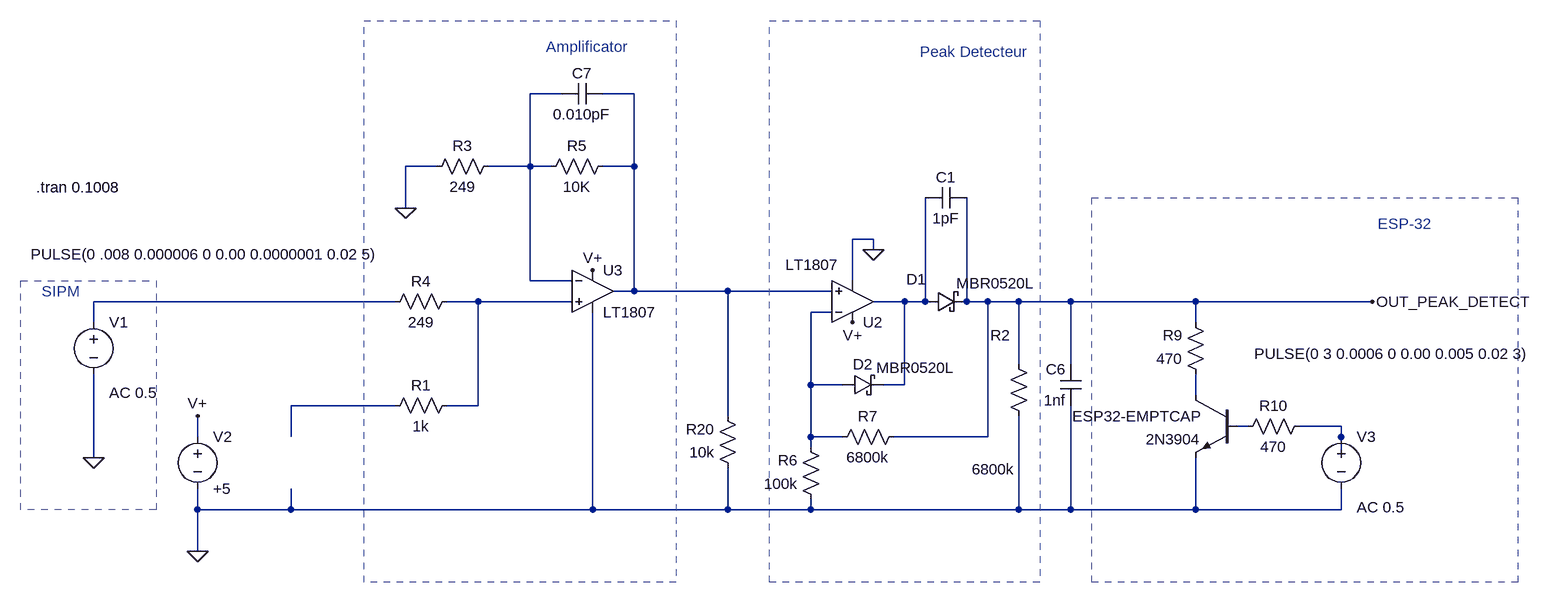
[diagram p0: schematic Muons_V4_a.asc]
Muons_V4_a.asc, the LTspice schematic file:
Version 4
SHEET 1 5945676 13421556
WIRE 624 -368 576 -368
WIRE 736 -368 688 -368
WIRE 432 -256 384 -256
WIRE 576 -256 576 -368
WIRE 576 -256 512 -256
WIRE 608 -256 576 -256
WIRE 736 -256 736 -368
WIRE 736 -256 688 -256
WIRE 384 -192 384 -256
WIRE 1104 -144 1072 -144
WIRE 1104 -128 1104 -144
WIRE 576 -80 576 -256
WIRE 640 -80 576 -80
WIRE 1072 -80 1072 -144
WIRE 736 -64 736 -256
WIRE 736 -64 704 -64
WIRE 880 -64 736 -64
WIRE 1040 -64 880 -64
WIRE 368 -48 -96 -48
WIRE 496 -48 448 -48
WIRE 640 -48 496 -48
WIRE 1152 -48 1104 -48
WIRE 1184 -48 1184 -208
WIRE 1184 -48 1152 -48
WIRE 1248 -48 1248 -208
WIRE 1280 -48 1248 -48
WIRE 1328 -48 1280 -48
WIRE 1408 -48 1328 -48
WIRE 1600 -48 1408 -48
WIRE 1872 -48 1600 -48
WIRE 1040 -32 1008 -32
WIRE -96 -16 -96 -48
WIRE 1600 -16 1600 -48
WIRE 1328 48 1328 -48
WIRE 1408 48 1408 -48
WIRE 1008 80 1008 -32
WIRE 1056 80 1008 80
WIRE 1152 80 1152 -48
WIRE 1152 80 1120 80
WIRE 1600 96 1600 64
WIRE 368 112 208 112
WIRE 496 112 496 -48
WIRE 496 112 448 112
WIRE 880 128 880 -64
WIRE 1680 144 1664 144
WIRE 1824 144 1760 144
WIRE 64 160 64 128
WIRE 208 160 208 112
WIRE 1008 160 1008 80
WIRE 1056 160 1008 160
WIRE 1280 160 1280 -48
WIRE 1280 160 1136 160
WIRE 1824 160 1824 144
WIRE 1008 176 1008 160
WIRE -96 192 -96 64
WIRE 1824 192 1824 160
WIRE 64 272 64 240
WIRE 208 272 208 240
WIRE 208 272 64 272
WIRE 672 272 672 -32
WIRE 672 272 208 272
WIRE 880 272 880 208
WIRE 880 272 672 272
WIRE 1008 272 1008 256
WIRE 1008 272 880 272
WIRE 1328 272 1328 128
WIRE 1328 272 1008 272
WIRE 1408 272 1408 112
WIRE 1408 272 1328 272
WIRE 1600 272 1600 192
WIRE 1600 272 1408 272
WIRE 1824 272 1824 240
WIRE 1824 272 1600 272
WIRE 64 336 64 272
FLAG -96 192 0
FLAG 64 336 0
FLAG 672 -96 V+
FLAG 64 128 V+
FLAG 384 -192 0
FLAG 1872 -48 OUT_PEAK_DETECT
FLAG 1072 -16 V+
FLAG 1104 -128 0
SYMBOL voltage -96 -32 R0
WINDOW 123 24 124 Left 2
WINDOW 39 0 0 Left 0
WINDOW 3 -97 -89 Left 2
SYMATTR Value2 AC 0.5
SYMATTR Value PULSE(0 .008 0.000006 0 0.00 0.0000001 0.02 5)
SYMATTR InstName V1
SYMBOL res 704 -272 R90
WINDOW 0 0 56 VBottom 2
WINDOW 3 32 56 VTop 2
SYMATTR InstName R5
SYMATTR Value 10K
SYMBOL res 464 -64 R90
WINDOW 0 0 56 VBottom 2
WINDOW 3 32 56 VTop 2
SYMATTR InstName R4
SYMATTR Value 249
SYMBOL res 528 -272 R90
WINDOW 0 0 56 VBottom 2
WINDOW 3 32 56 VTop 2
SYMATTR InstName R3
SYMATTR Value 249
SYMBOL cap 688 -384 R90
WINDOW 0 0 32 VBottom 2
WINDOW 3 32 32 VTop 2
SYMATTR InstName C7
SYMATTR Value 0.010pF
SYMBOL voltage 64 144 R0
WINDOW 123 0 0 Left 0
WINDOW 39 0 0 Left 0
SYMATTR InstName V2
SYMATTR Value +5
SYMBOL res 896 224 R180
WINDOW 0 36 76 Left 2
WINDOW 3 36 40 Left 2
SYMATTR InstName R20
SYMATTR Value 10k
SYMBOL cap 1424 112 R180
WINDOW 0 24 56 Left 2
WINDOW 3 24 8 Left 2
SYMATTR InstName C6
SYMATTR Value 1nf
SYMBOL OpAmps\\LT1807 1072 16 M180
WINDOW 3 -103 121 Left 2
SYMATTR InstName U2
SYMBOL OpAmps\\LT1807 672 -128 R0
SYMATTR InstName U3
SYMBOL schottky 1184 -32 R270
WINDOW 0 35 -14 VTop 2
WINDOW 3 60 108 VBottom 2
SYMATTR InstName D1
SYMATTR Value MBR0520L
SYMATTR Description Diode
SYMATTR Type diode
SYMBOL voltage 1824 144 R0
WINDOW 123 24 124 Left 2
WINDOW 39 0 0 Left 0
WINDOW 3 -134 -112 Left 2
SYMATTR Value2 AC 0.5
SYMATTR Value PULSE(0 3 0.0006 0 0.00 0.005 0.02 3)
SYMATTR InstName V3
SYMBOL res 1776 128 R90
WINDOW 0 0 56 VBottom 2
WINDOW 3 32 56 VTop 2
SYMATTR InstName R10
SYMATTR Value 470
SYMBOL npn 1664 96 M0
SYMATTR InstName ESP32-EMPTCAP
SYMATTR Value 2N3904
SYMBOL res 1024 272 R180
WINDOW 0 36 76 Left 2
WINDOW 3 36 40 Left 2
SYMATTR InstName R6
SYMATTR Value 100k
SYMBOL schottky 1056 96 R270
WINDOW 0 32 32 VTop 2
WINDOW 3 58 113 VBottom 2
SYMATTR InstName D2
SYMATTR Value MBR0520L
SYMATTR Description Diode
SYMATTR Type diode
SYMBOL res 1616 80 R180
WINDOW 0 36 76 Left 2
WINDOW 3 36 40 Left 2
SYMATTR InstName R9
SYMATTR Value 470
SYMBOL res 464 96 R90
WINDOW 0 0 56 VBottom 2
WINDOW 3 32 56 VTop 2
SYMATTR InstName R1
SYMATTR Value 1k
SYMBOL res 1344 144 R180
WINDOW 0 29 140 Left 2
WINDOW 3 22 -66 Left 2
SYMATTR InstName R2
SYMATTR Value 6800k
SYMBOL res 1040 176 R270
WINDOW 0 32 56 VTop 2
WINDOW 3 0 56 VBottom 2
SYMATTR InstName R7
SYMATTR Value 6800k
SYMBOL cap 1248 -224 R90
WINDOW 0 0 32 VBottom 2
WINDOW 3 32 32 VTop 2
SYMATTR InstName C1
SYMATTR Value 1pF
TEXT -184 -224 Left 2 !.tran 0.1008
TEXT 1176 -432 Left 2 ;Peak Detecteur
TEXT 600 -440 Left 2 ;Amplificator
TEXT 1880 -168 Left 2 ;ESP-32
TEXT -176 -64 Left 2 ;SIPM
RECTANGLE Normal 2096 384 1440 -208 2
RECTANGLE Normal 0 272 -208 -80 2
RECTANGLE Normal 1360 384 944 -480 2
RECTANGLE Normal 800 384 320 -480 2

The netlist it stands for:
* Muons_V4_a.asc
V1 N003 0 PULSE(0 .008 0.000006 0 0.00 0.0000001 0.02 5) AC 0.5
R5 N002 N001 10K
R4 N004 N003 249
R3 N001 0 249
C7 N002 N001 0.010pF
V2 V+ 0 +5
R20 0 N002 10k
C6 0 OUT_PEAK_DETECT 1nf
XU2 N002 N006 V+ 0 N005 LT1807  ; pins In+ In- V+ V- OUT
XU3 N004 N001 V+ 0 N002 LT1807  ; pins In+ In- V+ V- OUT
D1 N005 OUT_PEAK_DETECT MBR0520L
V3 N010 0 PULSE(0 3 0.0006 0 0.00 0.005 0.02 3) AC 0.5
R10 N010 N009 470
Q§ESP32-EMPTCAP N007 N009 0 0 2N3904
R6 0 N006 100k
D2 N006 N005 MBR0520L
R9 N007 OUT_PEAK_DETECT 470
R1 N004 N008 1k
R2 0 OUT_PEAK_DETECT 6800k
R7 N006 OUT_PEAK_DETECT 6800k
C1 OUT_PEAK_DETECT N005 1pF
.model D D
.lib standard.dio
.model NPN NPN
.model PNP PNP
.lib standard.bjt
.tran 0.1008
* Peak Detecteur
* Amplificator
* ESP-32
* SIPM
.backanno
.end